# Altium schematic sheet spiflash.SchDoc
size A2; SheetNumber: 1; SheetTotal: 1
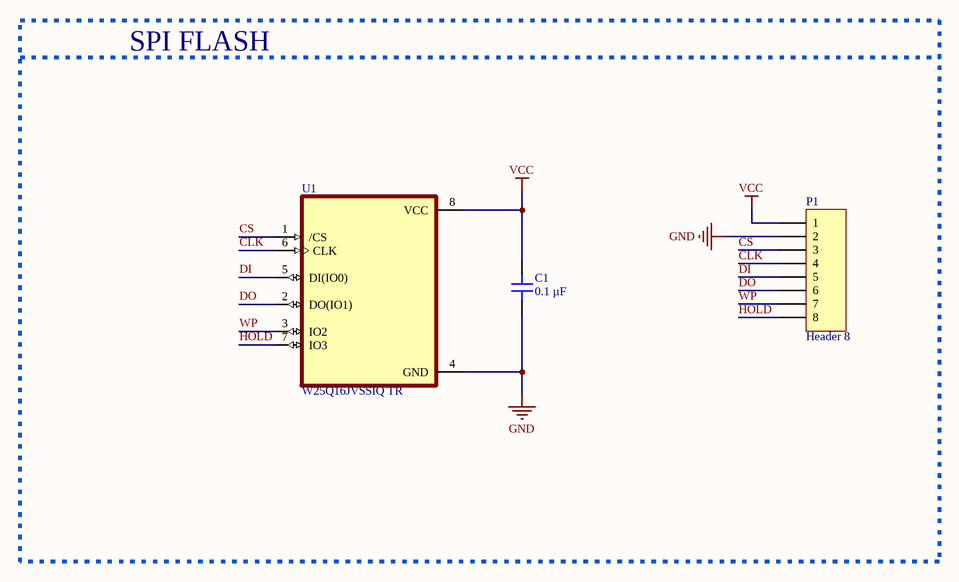
[diagram p0: spiflash.SchDoc]

## Parts
C1  0.1 µF  [CAP 0805_2012]
P1  Header 8  [HDR1X8]
U1  W25Q16JVSSIQ TR  [SOIC127P790X216-8N]

## Blocks framed on the sheet
SPI FLASH: C1 P1 U1

## Nets
GND: C1.1 P1.2 U1.4(GND)
VCC: C1.2 P1.1 U1.8(VCC)
CLK: P1.4 U1.6(CLK)
CS: P1.3 U1.1(/CS)
DI: P1.5 U1.5(DI(IO0))
DO: P1.6 U1.2(DO(IO1))
HOLD: P1.8 U1.7(IO3)
WP: P1.7 U1.3(IO2)

## Library data of the parts
C1 = CC0805MRX7R9BB104: CAP CER 0.1UF 50V X7R 0805; manufacturer: Yageo; Tolerance: ±20%; Part Number: CC0805MRX7R9BB104; Value: 0.1 µF; Applications: General Purpose; Capacitance: 0.1 µF; componentlink1description: Datasheet; componentlink1url: https://www.yageo.com/upload/media/product/productsearch/datasheet/mlcc/UPY-GPHC_X7R_6.3V-to-50V_18.pdf; componentlink2description: DigiKey Link; componentlink2url: https://www.digikey.com/en/products/detail/yageo/CC0805MRX7R9BB104/5884281; Device Package: 0805 (2012 Metric); lastupdated: 9.02.2024 20:16:09; Lifecycle Status: Active; Minimum Order: 1; Mounting Type: Surface Mount, MLCC; Operating Temperature: -55°C ~ 125°C; Package / Case: 0805 (2012 Metric); packaging: TapeAndReel; partid: 2475; Part Status: Active; price: 0.01; series: CC; Size / Dimension: 0.079" L x 0.049" W (2.00mm x 1.25mm); Supplier 1: DigiKey; Supplier Part Number 1: 311-4351-1-ND; Temperature Coefficient: X7R; Thickness (Max): 0.037" (0.95mm); Voltage - Rated: 50V
P1 = Header 8: Header, 8-Pin; LatestRevisionDate: 17-Jul-2002; LatestRevisionNote: Re-released for DXP Platform.; Publisher: Altium Limited
U1 = W25Q16JVSSIQ TR: IC FLASH 16MBIT SPI/QUAD 8SOIC; Manufacturer: Winbond Electronics; Detailed Description: FLASH - NOR Memory IC 16Mbit SPI - Quad I/O 133 MHz 8-SOIC; Datasheet: https://www.winbond.com/resource-files/w25q16jv%20spi%20revg%2003222018%20plus.pdf; UNIT PRICE: $0.58000; Manufacturer Product Number: W25Q16JVSSIQ TR; DigiKey Part Number: W25Q16JVSSIQTR-ND